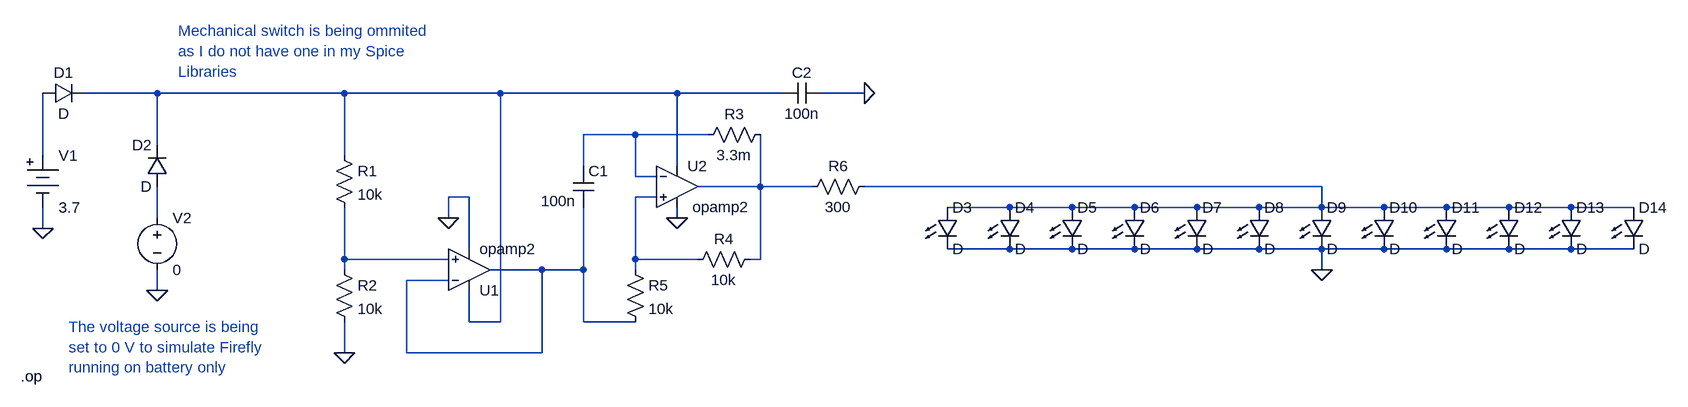
[diagram p0: schematic Firefly.asc]
Firefly.asc, the LTspice schematic file:
Version 4
SHEET 1 3004 680
WIRE 672 -288 560 -288
WIRE 960 -288 672 -288
WIRE 1200 -288 960 -288
WIRE 1472 -288 1200 -288
WIRE 1632 -288 1472 -288
WIRE 1760 -288 1696 -288
WIRE 1408 -224 1328 -224
WIRE 1520 -224 1408 -224
WIRE 672 -208 672 -288
WIRE 496 -192 496 -288
WIRE 960 -192 960 -288
WIRE 1328 -176 1328 -224
WIRE 1472 -176 1472 -288
WIRE 1408 -160 1408 -224
WIRE 1440 -160 1408 -160
WIRE 1600 -144 1600 -224
WIRE 1600 -144 1504 -144
WIRE 1680 -144 1600 -144
WIRE 2464 -144 1760 -144
WIRE 1152 -128 1120 -128
WIRE 1440 -128 1408 -128
WIRE 1984 -112 1888 -112
WIRE 2080 -112 1984 -112
WIRE 2176 -112 2080 -112
WIRE 2272 -112 2176 -112
WIRE 2368 -112 2272 -112
WIRE 2464 -112 2464 -144
WIRE 2464 -112 2368 -112
WIRE 2560 -112 2464 -112
WIRE 2656 -112 2560 -112
WIRE 2752 -112 2656 -112
WIRE 2848 -112 2752 -112
WIRE 2944 -112 2848 -112
WIRE 672 -96 672 -144
WIRE 1120 -96 1120 -128
WIRE 1472 -96 1472 -112
WIRE 496 -80 496 -112
WIRE 1152 -48 1152 -128
WIRE 1984 -48 1888 -48
WIRE 2080 -48 1984 -48
WIRE 2176 -48 2080 -48
WIRE 2272 -48 2176 -48
WIRE 2368 -48 2272 -48
WIRE 2464 -48 2464 -64
WIRE 2464 -48 2368 -48
WIRE 2560 -48 2464 -48
WIRE 2656 -48 2560 -48
WIRE 2752 -48 2656 -48
WIRE 2848 -48 2752 -48
WIRE 2944 -48 2848 -48
WIRE 960 -32 960 -112
WIRE 1120 -32 960 -32
WIRE 1408 -32 1408 -128
WIRE 1504 -32 1408 -32
WIRE 1600 -32 1600 -144
WIRE 1600 -32 1584 -32
WIRE 960 -16 960 -32
WIRE 1264 -16 1184 -16
WIRE 1328 -16 1328 -112
WIRE 1328 -16 1264 -16
WIRE 1408 -16 1408 -32
WIRE 2464 -16 2464 -48
WIRE 1120 0 1056 0
WIRE 672 16 672 -16
WIRE 1152 64 1152 16
WIRE 1200 64 1200 -288
WIRE 1200 64 1152 64
WIRE 1328 64 1328 -16
WIRE 1408 64 1328 64
WIRE 960 112 960 64
WIRE 1056 112 1056 0
WIRE 1264 112 1264 -16
WIRE 1264 112 1056 112
FLAG 496 -80 0
FLAG 672 16 0
FLAG 960 112 0
FLAG 1120 -96 0
FLAG 1472 -96 0
FLAG 1760 -288 0
FLAG 2464 -16 0
SYMBOL Misc\\battery 496 -208 R0
WINDOW 123 0 0 Left 0
WINDOW 39 0 0 Left 0
SYMATTR InstName V1
SYMATTR Value 3.7
SYMBOL diode 496 -272 R270
WINDOW 0 32 32 VTop 2
WINDOW 3 0 32 VBottom 2
SYMATTR InstName D1
SYMBOL diode 688 -144 R180
WINDOW 0 24 64 Left 2
WINDOW 3 24 0 Left 2
SYMATTR InstName D2
SYMBOL voltage 672 -112 R0
WINDOW 123 0 0 Left 0
WINDOW 39 0 0 Left 0
SYMATTR InstName V2
SYMATTR Value 0
SYMBOL res 944 -208 R0
SYMATTR InstName R1
SYMATTR Value 10k
SYMBOL res 944 -32 R0
SYMATTR InstName R2
SYMATTR Value 10k
SYMBOL Opamps\\opamp2 1152 48 M180
SYMATTR InstName U1
SYMBOL cap 1312 -176 R0
WINDOW 3 -49 54 Left 2
SYMATTR InstName C1
SYMATTR Value 100n
SYMBOL Opamps\\opamp2 1472 -208 R0
WINDOW 3 24 95 Left 2
SYMATTR InstName U2
SYMBOL res 1616 -240 R90
WINDOW 0 0 56 VBottom 2
WINDOW 3 32 56 VTop 2
SYMATTR InstName R3
SYMATTR Value 3.3m
SYMBOL res 1600 -48 R90
WINDOW 0 0 56 VBottom 2
WINDOW 3 32 56 VTop 2
SYMATTR InstName R4
SYMATTR Value 10k
SYMBOL res 1392 -32 R0
SYMATTR InstName R5
SYMATTR Value 10k
SYMBOL cap 1696 -304 R90
WINDOW 0 0 32 VBottom 2
WINDOW 3 32 32 VTop 2
SYMATTR InstName C2
SYMATTR Value 100n
SYMBOL res 1776 -160 R90
WINDOW 0 0 56 VBottom 2
WINDOW 3 32 56 VTop 2
SYMATTR InstName R6
SYMATTR Value 300
SYMBOL LED 1872 -112 R0
SYMATTR InstName D3
SYMBOL LED 1968 -112 R0
SYMATTR InstName D4
SYMBOL LED 2064 -112 R0
SYMATTR InstName D5
SYMBOL LED 2160 -112 R0
SYMATTR InstName D6
SYMBOL LED 2256 -112 R0
SYMATTR InstName D7
SYMBOL LED 2352 -112 R0
SYMATTR InstName D8
SYMBOL LED 2448 -112 R0
SYMATTR InstName D9
SYMBOL LED 2544 -112 R0
SYMATTR InstName D10
SYMBOL LED 2640 -112 R0
SYMATTR InstName D11
SYMBOL LED 2736 -112 R0
SYMATTR InstName D12
SYMBOL LED 2832 -112 R0
SYMATTR InstName D13
SYMBOL LED 2928 -112 R0
SYMATTR InstName D14
TEXT 704 -384 Left 2 ;Mechanical switch is being ommited\nas I do not have one in my Spice \nLibraries
TEXT 536 72 Left 2 ;The voltage source is being\nset to 0 V to simulate Firefly\nrunning on battery only
TEXT 462 148 Left 2 !.op

The netlist it stands for:
* Firefly.asc
V1 N003 0 3.7
D1 N003 N001 D
D2 N007 N001 D
V2 N007 0 0
R1 N001 N008 10k
R2 N008 0 10k
XU1 N008 N009 N001 0 N009 opamp2  ; pins In+ In- V+ V- OUT
C1 N002 N009 100n
XU2 N006 N002 N001 0 N004 opamp2  ; pins In+ In- V+ V- OUT
R3 N004 N002 3.3m
R4 N004 N006 10k
R5 N006 N009 10k
C2 0 N001 100n
R6 N005 N004 300
D3 N005 0 D
D4 N005 0 D
D5 N005 0 D
D6 N005 0 D
D7 N005 0 D
D8 N005 0 D
D9 N005 0 D
D10 N005 0 D
D11 N005 0 D
D12 N005 0 D
D13 N005 0 D
D14 N005 0 D
.model D D
.lib standard.dio
* Mechanical switch is being ommited
* as I do not have one in my Spice
* Libraries
* The voltage source is being
* set to 0 V to simulate Firefly
* running on battery only
.op
.backanno
.end